# Altium schematic sheet COVER.SchDoc: My title
size A3; Organization: University of California; Address1: 475 Portola Plaza; Address2: Los Angeles, CA 90095; DocumentNumber: 1; Revision: R01; SheetNumber: 1; SheetTotal: 35
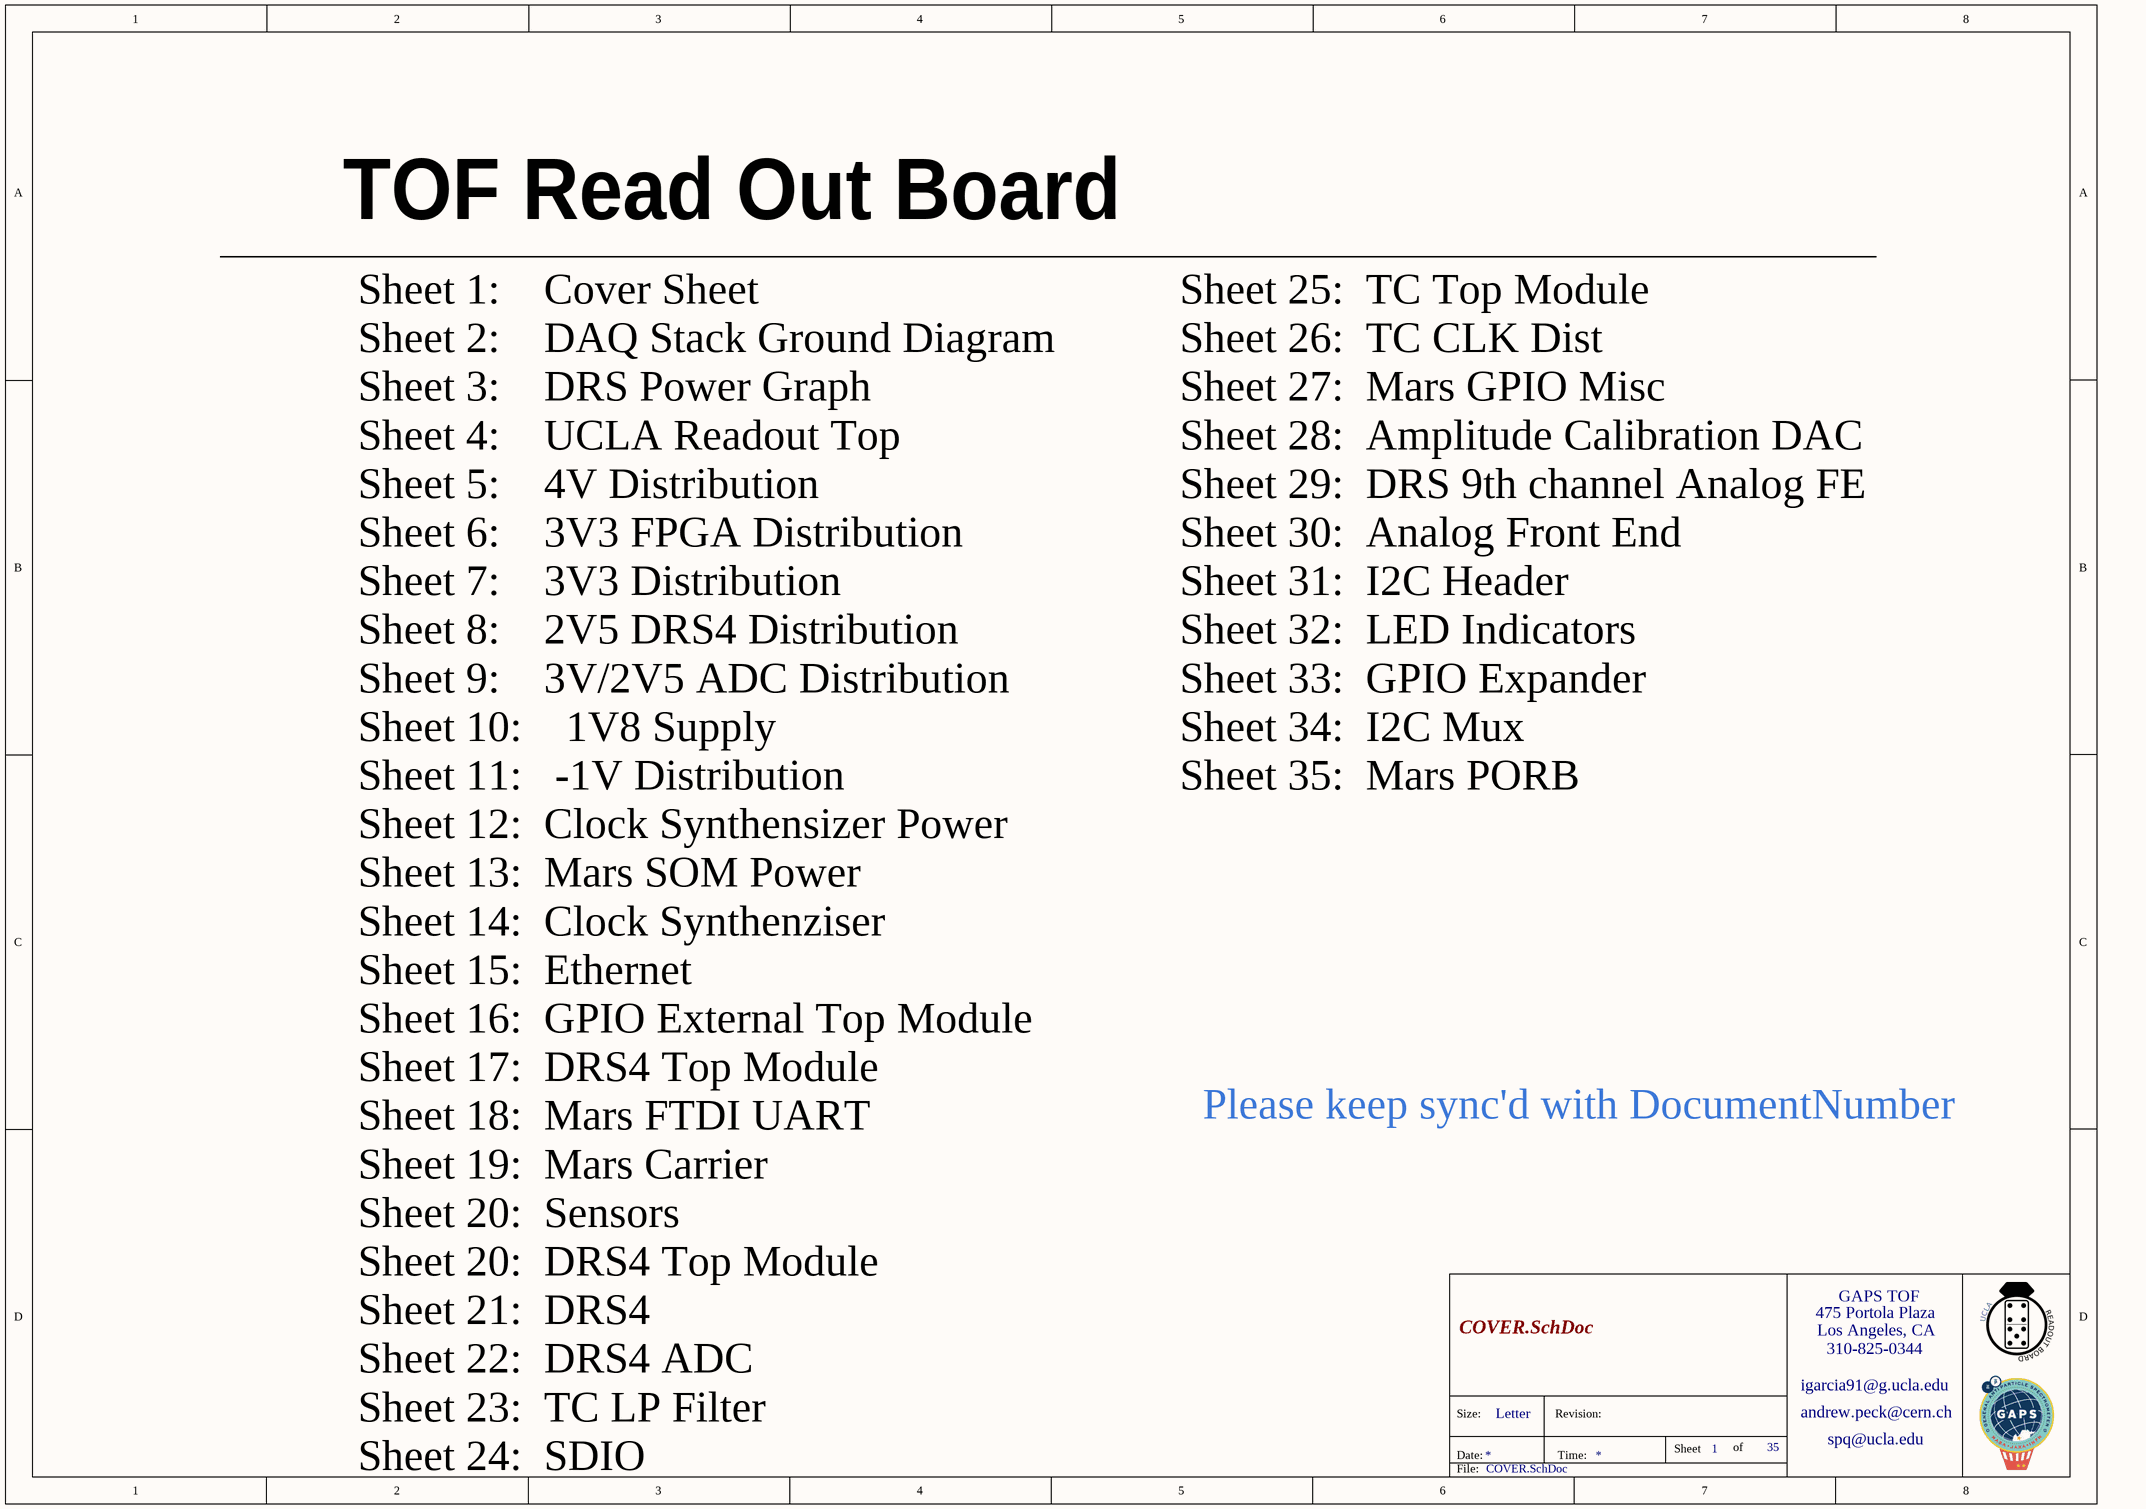
[diagram p0: COVER.SchDoc]

## Notes on the sheet
- TOF Read Out Board
- Sheet 25:  TC Top Module
  Sheet 26:  TC CLK Dist
  Sheet 27:  Mars GPIO Misc
  Sheet 28:  Amplitude Calibration DAC
  Sheet 29:  DRS 9th channel Analog FE
  Sheet 30:  Analog Front End
  Sheet 31:  I2C Header
  Sheet 32:  LED Indicators
  Sheet 33:  GPIO Expander
  Sheet 34:  I2C Mux
  Sheet 35:  Mars PORB
- Please keep sync'd with DocumentNumber
- Sheet 1:    Cover Sheet
  Sheet 2:    DAQ Stack Ground Diagram
  Sheet 3:    DRS Power Graph
  Sheet 4:    UCLA Readout Top
  Sheet 5:    4V Distribution
  Sheet 6:    3V3 FPGA Distribution
  Sheet 7:    3V3 Distribution
  Sheet 8:    2V5 DRS4 Distribution
  Sheet 9:    3V/2V5 ADC Distribution
  Sheet 10:    1V8 Supply
  Sheet 11:   -1V Distribution
  Sheet 12:  Clock Synthensizer Power
  Sheet 13:  Mars SOM Power
  Sheet 14:  Clock Synthenziser
  Sheet 15:  Ethernet
  Sheet 16:  GPIO External Top Module
  Sheet 17:  DRS4 Top Module
  Sheet 18:  Mars FTDI UART
  Sheet 19:  Mars Carrier
  Sheet 20:  Sensors
  Sheet 20:  DRS4 Top Module
  Sheet 21:  DRS4
  Sheet 22:  DRS4 ADC
  Sheet 23:  TC LP Filter
  Sheet 24:  SDIO
- 475 Portola Plaza
- GAPS TOF
- igarcia91@g.ucla.edu
- Los Angeles, CA
- 310-825-0344
- Size:
- Date:
- Letter
- Revision:
- Time:
- Sheet
- of
- andrew.peck@cern.ch
- spq@ucla.edu
- File: